# Altium project sanati.PrjPcb
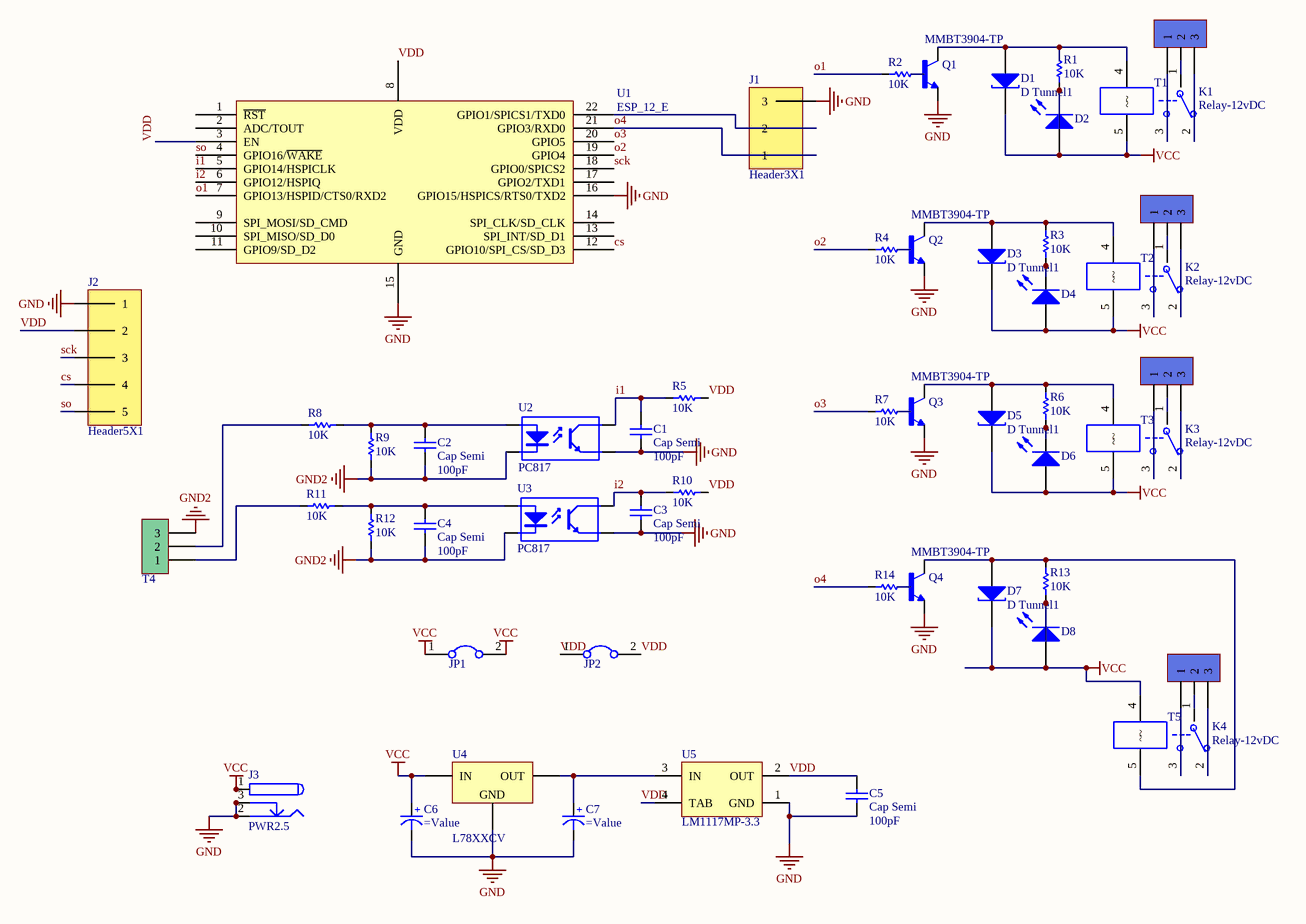
[diagram p0: sanati4i4o.SchDoc]
1 sheet, 52 parts. Net scope: global (net labels, ports and power ports of the same name join across sheets).
Board file: sanati4i4o.PcbDoc

## Sheet sanati4i4o.SchDoc
size A3

### Parts
C1  Cap Semi  value 100pF  [C1206]
C2  Cap Semi  value 100pF  [C1206]
C3  Cap Semi  value 100pF  [C1206]
C4  Cap Semi  value 100pF  [C1206]
C5  Cap Semi  value 100pF  [C1206]
C6  (no value)  [ELEC-CAP-RAD10-20]
C7  (no value)  [ELEC-CAP-RAD10-20]
D1  D Tunnel1  [3.2X1.6X1.1]
D2  LED 3mm  [LED-3mm]  (value not drawn)
D3  D Tunnel1  [3.2X1.6X1.1]
D4  LED 3mm  [LED-3mm]  (value not drawn)
D5  D Tunnel1  [3.2X1.6X1.1]
D6  LED 3mm  [LED-3mm]  (value not drawn)
D7  D Tunnel1  [3.2X1.6X1.1]
D8  LED 3mm  [LED-3mm]  (value not drawn)
J1  Header3X1  [HEADER 3X1]
J2  Header5X1  [HEADER 5X1]
J3  PWR2.5  [KLD-0202]
JP1  Jumper  [Header 2X1]  (value not drawn)
JP2  Jumper  [Header 2X1]  (value not drawn)
K1  Relay-12vDC  [Relays]
K2  Relay-12vDC  [Relays]
K3  Relay-12vDC  [Relays]
K4  Relay-12vDC  [Relays]
Q1  MMBT3904-TP  [SOT23-3]
Q2  MMBT3904-TP  [SOT23-3]
Q3  MMBT3904-TP  [SOT23-3]
Q4  MMBT3904-TP  [SOT23-3]
R1  10K  [RES 1206 (3216X08L)]
R2  10K  [RES 1206 (3216X08L)]
R3  10K  [RES 1206 (3216X08L)]
R4  10K  [RES 1206 (3216X08L)]
R5  10K  [Res-(1/4)]
R6  10K  [RES 1206 (3216X08L)]
R7  10K  [RES 1206 (3216X08L)]
R8  10K  [RES 1206 (3216X08L)]
R9  10K  [RES 1206 (3216X08L)]
R10  10K  [Res-(1/4)]
R11  10K  [RES 1206 (3216X08L)]
R12  10K  [RES 1206 (3216X08L)]
R13  10K  [RES 1206 (3216X08L)]
R14  10K  [RES 1206 (3216X08L)]
T1  Terminal  [phoenix terminal R 3]  (value not drawn)
T2  Terminal  [phoenix terminal R 3]  (value not drawn)
T3  Terminal  [phoenix terminal R 3]  (value not drawn)
T4  Phoenix terminal  [phoenix terminal R 3]  (value not drawn)
T5  Terminal  [phoenix terminal R 3]  (value not drawn)
U1  ESP_12_E  [ESP_12_E]
U2  PC817  [DIP4]
U3  PC817  [DIP4]
U4  L78XXCV  [TO-220]
U5  LM1117MP-3.3  [MP04A_N]

### Nets
GND: C1.1 C3.1 C5.1 C6.1(-) C7.1(-) J1.3 J2.1 J3.2 J3.2A J3.2B J3.3 J3.3A J3.3B Q1.2(E) Q2.2(E) Q3.2(E) Q4.2(E) U1.15(GND) U1.16(GPIO15/HSPICS/RTS0/TXD2) U2.3(E) U3.3(E) U4.2(GND) U5.1(GND)
GND2: C2.1 C4.1 R9.1 R12.1 T4.3 U2.2(K) U3.2(K)
VCC: C6.2(+) D1.2(K) D2.1(A) D3.2(K) D4.1(A) D5.2(K) D6.1(A) D7.2(K) D8.1(A) J3.1 J3.1A J3.1B JP1.1 JP1.2 K1.5 K2.5 K3.5 K4.4 U4.1(IN)
cs: J2.4 U1.12(GPIO10/SPI_CS/SD_D3)
i1: C1.2 R5.1 U1.5(GPIO14/HSPICLK) U2.4(C)
i2: C3.2 R10.1 U1.6(GPIO12/HSPIQ) U3.4(C)
o1: R2.1 U1.7(GPIO13/HSPID/CTS0/RXD2)
o2: R4.1 U1.19(GPIO4)
o3: R7.1 U1.20(GPIO5)
o4: J1.1 R14.1 U1.21(GPIO3/RXD0)
sck: J2.3 U1.18(GPIO0/SPICS2)
so: J2.5 U1.4(GPIO16/~{WAKE})
VDD: C5.2 J2.2 JP2.1 JP2.2 R5.2 R10.2 U1.3(EN) U1.8(VDD) U5.2(OUT) U5.4(TAB)
NetC2_2: C2.2 R8.2 R9.2 U2.1(A)
NetC4_2: C4.2 R11.2 R12.2 U3.1(A)
NetC7_2: C7.2(+) U4.3(OUT) U5.3(IN)
NetD1_1: D1.1(A) K1.4 Q1.3(C) R1.2
NetD2_2: D2.2(K) R1.1
NetD3_1: D3.1(A) K2.4 Q2.3(C) R3.2
NetD4_2: D4.2(K) R3.1
NetD5_1: D5.1(A) K3.4 Q3.3(C) R6.2
NetD6_2: D6.2(K) R6.1
NetD7_1: D7.1(A) K4.5 Q4.3(C) R13.2
NetD8_2: D8.2(K) R13.1
NetJ1_2: J1.2 U1.22(GPIO1/SPICS1/TXD0)
NetK1_1: K1.1(COM) T1.2
NetK1_2: K1.2(NC) T1.3
NetK1_3: K1.3(NO) T1.1
NetK2_1: K2.1(COM) T2.2
NetK2_2: K2.2(NC) T2.3
NetK2_3: K2.3(NO) T2.1
NetK3_1: K3.1(COM) T3.2
NetK3_2: K3.2(NC) T3.3
NetK3_3: K3.3(NO) T3.1
NetK4_1: K4.1(COM) T5.2
NetK4_2: K4.2(NC) T5.3
NetK4_3: K4.3(NO) T5.1
NetQ1_1: Q1.1(B) R2.2
NetQ2_1: Q2.1(B) R4.2
NetQ3_1: Q3.1(B) R7.2
NetQ4_1: Q4.1(B) R14.2
NetR8_1: R8.1 T4.2
NetR11_1: R11.1 T4.1

Not connected (* = marked no-connect by the designer): U1 1(~{RST}) 2(ADC/TOUT) 9(SPI_MOSI/SD_CMD) 10(SPI_MISO/SD_D0) 11(GPIO9/SD_D2) 13(SPI_INT/SD_D1) 14(SPI_CLK/SD_CLK) 17(GPIO2/TXD1)

### Library data of the parts
C1-C5 = Cap Semi: Capacitor (Semiconductor SIM Model); Published: 8-Jun-2000; LatestRevisionDate: 29-May-2009; LatestRevisionNote: IPC-7351 Footprint Added.; PackageReference: C1206; Publisher: Altium Limited; PackageDescription: Chip Capacitor
C6 C7 = Capacitor Electrolytic: Electrolytic Capacitor
D1 D3 D5 D7 = D Tunnel1: Tunnel Diode - RLC Model; Published: 8-Jun-2000; LatestRevisionDate: 17-Jul-2002; LatestRevisionNote: Re-released for DXP Platform.; PackageVersion: Feb-2002; PackageReference: 3.2X1.6X1.1; Publisher: Altium Limited; PackageDescription: SM LED; 2 Flat Leads
D2 D4 D6 D8 = LED 3mm: Typical LED; Designer: Seyed Mohsen Ghasemian; Published: 02/04/2012; PackageReference: LED; Publisher: www.picpars.com; PackageDescription: LED; 2 Leads
J3 = PWR2.5: Low Voltage Power Supply Connector; Published: 17-Dec-2003; DatasheetDocument: 09-May-2002; Publisher: Altium Limited; ComponentLink1Description: Manufacturer Link; ComponentLink1URL: http://domino.kycon.com/internet/Products.html
K1-K4 = Relay-05vDC: Relay-05vDC-240AC 5A; Designer: Seyed Mohsen Ghasemain; ComponentLinkURL: www.picpars.com
Q1-Q4 = MMBT3904-TP: Bipolar _BJT_ Transistor NPN 40V 200mA 300MHz 350mW Surface Mount SOT-23; MF: Micro Commercial; Value: *; MP: MMBT3904-TP; Package: SOT-23 Micro Commercial; Price: None; Availability: Unavailable; SnapEDA_Link: https://www.snapeda.com/parts/MMBT3904-TP/Micro%20Commercial/view-part/805928/?ref=snap
R1-R14 = Resistor: Tolerance: 5%; Power: 1/4 W; Value: 10K
T1-T3 T5 = Terminal 1*3: phoenix terminal R 3; Designer: Seyed Mohsen Ghasemain; E-mail: picpars@gmail.com; ComponentLinkURL: www.picpars.com
T4 = Phoenix terminal R 3: Right Terminal 3 Pin; Designer: Seyed Mohsen Ghasemain; E-mail: picpars@gmail.com; ComponentLinkURL: www.picpars.com
U1 = ESP_12_E: ESP-12 Wi-Fi Module by AI-Thinker; IC: ESP8266-EX; Vendor: Ai-thinker
U2 U3 = OPTCOUPLER_01: 4-Pin Phototransistor Optocoupler
U4 = L78XXCV: Fixed Voltage Regulator
U5 = LM1117MP-3.3: 800mA Low-Dropout Linear Regulator; Manufacturer: National Semiconductor; CompType: LDO IC; PackageTopMarking: XYTT*N05A; PowerWise: N; Published: 4-Dec-2008; DatasheetVersion: Apr-2006; PackageVersion: revB, Apr-2003; PackageReference: MP04A; Publisher: Altium Limited; PackageDescription: Molded SOT-223, 6.50 x 3.56 x 1.6mm Body, 4 Lead, 2.3mm Pitch; PartNumber: LM1117MP-3.3; RoHS: O; PinCount: 4; DigiKeyPartNumber: LM1117MP-3.3CT-ND; Code_JEDEC: TO-261-AA; Code_IPC: SOT223-4; ComponentLink1Description: LM1117 Datasheet; ComponentLink1URL: http://www.national.com/ds/LM/LM1117.pdf; ComponentLink2Description: LM1117 Web Page; ComponentLink2URL: http://www.national.com/pf/LM/LM1117.html; ComponentLink3Description: MP04A Package Page; ComponentLink3URL: http://www.national.com/packaging/folders/mp04a.html